# Altium schematic sheet Controller.SchDoc
size A4; SheetNumber: 1; SheetTotal: 2
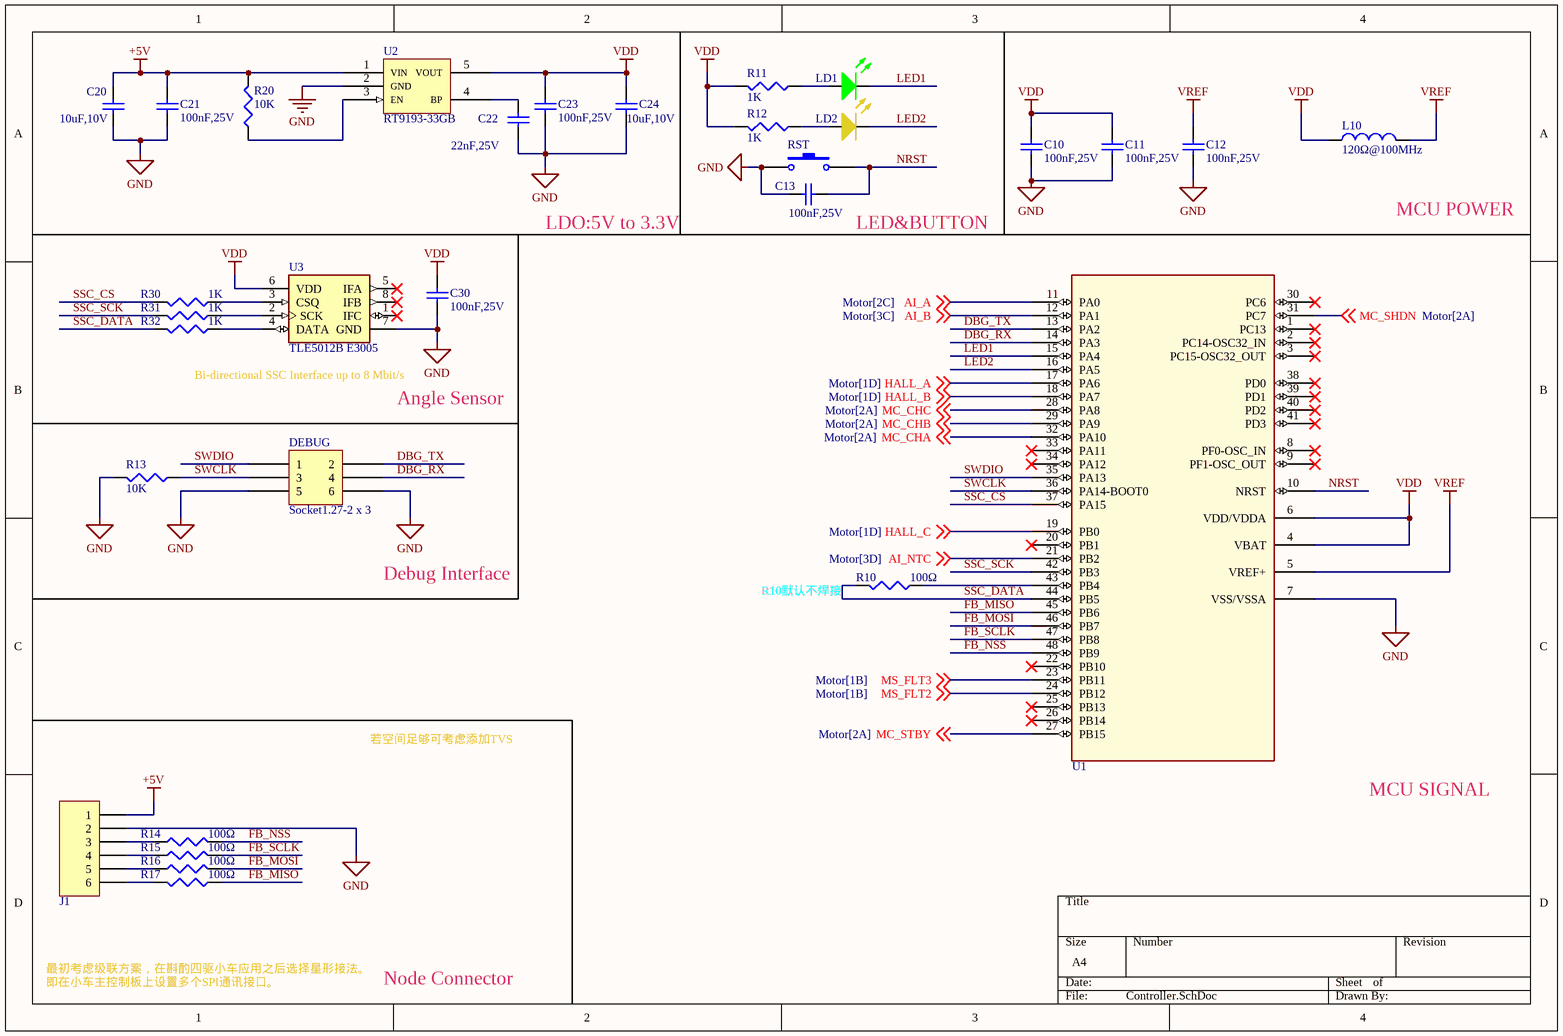
[diagram p0: Controller.SchDoc]

## Parts
C10  value 100nF,25V  [CAPC1005L]  (hidden comment: MLCC)
C11  value 100nF,25V  [CAPC1005L]  (hidden comment: MLCC)
C12  value 100nF,25V  [CAPC1005L]  (hidden comment: MLCC)
C13  value 100nF,25V  [CAPC1005L]  (hidden comment: MLCC)
C20  value 10uF,10V  [CAPC1608L]  (hidden comment: MLCC)
C21  value 100nF,25V  [CAPC1005L]  (hidden comment: MLCC)
C22  value 22nF,25V  [CAPC1005L]  (hidden comment: MLCC)
C23  value 100nF,25V  [CAPC1005L]  (hidden comment: MLCC)
C24  value 10uF,10V  [CAPC1608L]  (hidden comment: MLCC)
C30  value 100nF,25V  [CAPC1005L]  (hidden comment: MLCC)
DEBUG  Socket1.27-2 x 3  [Socket_1.27_V_2 x 03]
J1  B6B-PH-K-S  [B6B-PH-K-S]  (value not drawn)
L10  value 120Ω@100MHz  [0402-A]  (hidden comment: Inductor)
LD1  LED_0603_GREEN  [LED_0603_AK_Green]  (value not drawn)
LD2  LED  [LED_0603_AK_Yellow]  (value not drawn)
R10  value 100Ω  [RESC1005L]  (hidden comment: RES, SMT)
R11  value 1K  [RESC1005L]  (hidden comment: RES, SMT)
R12  value 1K  [RESC1005L]  (hidden comment: RES, SMT)
R13  value 10K  [RESC1005L]  (hidden comment: RES, SMT)
R14  value 100Ω  [RESC1005L]  (hidden comment: RES, SMT)
R15  value 100Ω  [RESC1005L]  (hidden comment: RES, SMT)
R16  value 100Ω  [RESC1005L]  (hidden comment: RES, SMT)
R17  value 100Ω  [RESC1005L]  (hidden comment: RES, SMT)
R20  value 10K  [RESC1005L]  (hidden comment: RES, SMT)
R30  value 1K  [RESC1005L]  (hidden comment: RES, SMT)
R31  value 1K  [RESC1005L]  (hidden comment: RES, SMT)
R32  value 1K  [RESC1005L]  (hidden comment: RES, SMT)
RST  switch  [SW2_3*2*0.6]  (value not drawn)
U1  STM32G070CBT6  [LQFP48-L]  (value not drawn)
U2  RT9193-33GB  [SOT-25]
U3  TLE5012B E3005  [Infineon_PG-DSO-8]

## Nets
+5V: C20.2 C21.2 J1.1 R20.2 U2.1(VIN)
GND: C10.1 C11.1 C12.1 C13.2 C20.1 C21.1 C22.1 C23.1 C24.1 C30.1 DEBUG.5 DEBUG.6 J1.2 R13.2 RST.1 U1.7(VSS/VSSA) U2.2(GND) U3.7(GND)
VDD: C10.2 C11.2 C23.2 C24.2 C30.2 L10.2 R11.2 R12.2 U1.4(VBAT) U1.6(VDD/VDDA) U2.5(VOUT) U3.6(VDD)
VREF: C12.2 L10.1 U1.5(VREF+)
AI_A: U1.11(PA0) ; off-sheet AI_A
AI_B: U1.12(PA1) ; off-sheet AI_B
AI_NTC: U1.21(PB2) ; off-sheet AI_NTC
DBG_RX: DEBUG.4 U1.14(PA3)
DBG_TX: DEBUG.2 U1.13(PA2)
FB_MISO: R17.1 U1.45(PB6)
FB_MOSI: R16.2 U1.46(PB7)
FB_NSS: R14.2 U1.48(PB9)
FB_SCLK: R15.2 U1.47(PB8)
HALL_A: U1.17(PA6) ; off-sheet HALL_A
HALL_B: U1.18(PA7) ; off-sheet HALL_B
HALL_C: U1.19(PB0) ; off-sheet HALL_C
LED1: LD1.K U1.15(PA4)
LED2: LD2.K U1.16(PA5)
MC_CHA: U1.32(PA10) ; off-sheet MC_CHA
MC_CHB: U1.29(PA9) ; off-sheet MC_CHB
MC_CHC: U1.28(PA8) ; off-sheet MC_CHC
MC_SHDN: U1.31(PC7) ; off-sheet MC_SHDN
MC_STBY: U1.27(PB15) ; off-sheet MC_STBY
MS_FLT2: U1.24(PB12) ; off-sheet MS_FLT2
MS_FLT3: U1.23(PB11) ; off-sheet MS_FLT3
NRST: C13.1 RST.2 U1.10(NRST)
SSC_CS: R30.2 U1.37(PA15)
SSC_DATA: R10.2 R32.2 U1.44(PB5)
SSC_SCK: R31.2 U1.42(PB3)
SWCLK: DEBUG.3 R13.1 U1.36(PA14-BOOT0)
SWDIO: DEBUG.1 U1.35(PA13)
NetC22_2: C22.2 U2.4(BP)
NetJ1_3: J1.3 R14.1
NetJ1_4: J1.4 R15.1
NetJ1_5: J1.5 R16.1
NetJ1_6: J1.6 R17.2
NetLD1_A: LD1.A R11.1
NetLD2_A: LD2.A R12.1
NetR10_1: R10.1 U1.43(PB4)
NetR20_1: R20.1 U2.3(EN)
NetR30_1: R30.1 U3.3(CSQ)
NetR31_1: R31.1 U3.2(SCK)
NetR32_1: R32.1 U3.4(DATA)

Not connected (* = marked no-connect by the designer): U1 1(PC13)* 2(PC14-OSC32_IN)* 3(PC15-OSC32_OUT)* 8(PF0-OSC_IN)* 9(PF1-OSC_OUT)* 20(PB1)* 22(PB10)* 25(PB13)* 26(PB14)* 30(PC6)* 33(PA11)* 34(PA12)* 38(PD0)* 39(PD1)* 40(PD2)* 41(PD3)*; U3 1(IFC)* 5(IFA)* 8(IFB)*

## Notes on the sheet
- LDO:5V to 3.3V
- LED&BUTTON
- MCU POWER
- Bi-directional SSC Interface up to 8 Mbit/s
- Angle Sensor
- Debug Interface
- R10默认不焊接
- 若空间足够可考虑添加TVS
- MCU SIGNAL
- 最初考虑级联方案，在斟酌四驱小车应用之后选择星形接法。
- 即在小车主控制板上设置多个SPI通讯接口。
- Node Connector

## Library data of the parts
C10-C13 C21-C23 C30 = Cap: MLCC, 0402(1005); Published: 8-Jun-2000; LatestRevisionDate: 17-Jul-2002; LatestRevisionNote: Re-released for DXP Platform.; PackageReference: RAD-0.3; Publisher: Altium Limited; PackageDescription: Radial Cap, Thru-Hole; 2 Leads; 0.3 in Pin Spacing
C20 C24 = Cap: MLCC, 0603(1608); Published: 8-Jun-2000; LatestRevisionDate: 17-Jul-2002; LatestRevisionNote: Re-released for DXP Platform.; PackageReference: RAD-0.3; Publisher: Altium Limited; PackageDescription: Radial Cap, Thru-Hole; 2 Leads; 0.3 in Pin Spacing
DEBUG = Socket1.27-3x2: Socket with 1.27mm gap, 3x2 pins
J1 = B6B-PH-K-S: B6B-PH-K-S or PH2.0 vertical throughhole,5 pins,Gap:2mm
L10 = Inductor: Ferrite Bead; Code_IEC: 1005; Published: 8-Jun-2000; LatestRevisionDate: 29-May-2009; LatestRevisionNote: IPC-7351 Footprint Added.; PackageReference: 0402-A; Publisher: Altium Limited; PackageDescription: Chip Inductor; Code_JEITA: 0402
LD1 = LED_0603_GREEN: GREEN LED, 0603
LD2 = LED_0603_YELLOW: YELLOW LED, 0603
R10-R17 R20 R30-R32 = Res3: Resistor, 0402(1005); Published: 8-Jun-2000; LatestRevisionDate: 29-May-2009; LatestRevisionNote: IPC-7351 Footprint Added.; PackageReference: J1-0603; Publisher: Altium Limited; PackageDescription: Chip Resistor
RST = SW-SPST-2P
U1 = STM32G070CBTx: The STM32G070CB/KB/RB mainstream microcontrollers are based on high-performance Arm® Cortex®-M0+ 32-bit RISC core operating at up to 64 MHz frequency. / 128 Kbytes of Flash program memory and 36 Kbytes of SRAM. With 48pin LQFP 7x7x1.4 package; Manufacturer_Part_Number: stm32g0_lqfp48_t2; Vendor: STMicroelectronics; Copyright: Copyright (C) 2018 Accelerated Designs. All rights reserved; RefDes: RefDes; Type: DEV; Value: Value
U2 = RT9193-xxGB: RICHTEK RT9193-xxGB with SOT-23-5. xx could be 15...50(1.5V...5.0V),1H(1.85V),2H(2.85V),4G(4.75V).; ComponentLink1Description: Datasheet; ComponentLink1URL: https://www.richtek.com/assets/product_file/RT9193/DS9193-17.pdf; ComponentLink2Description: Website; ComponentLink2URL: https://www.richtek.com/Products/Linear%20Regulator/Single%20Output%20Linear%20Regulator/RT9193?sc_lang=en
U3 = TLE5012B: Infineon, TLE5012B magnetic angle sensor for steering angle measurement. SOIC-8(PG-DSO-8) package.